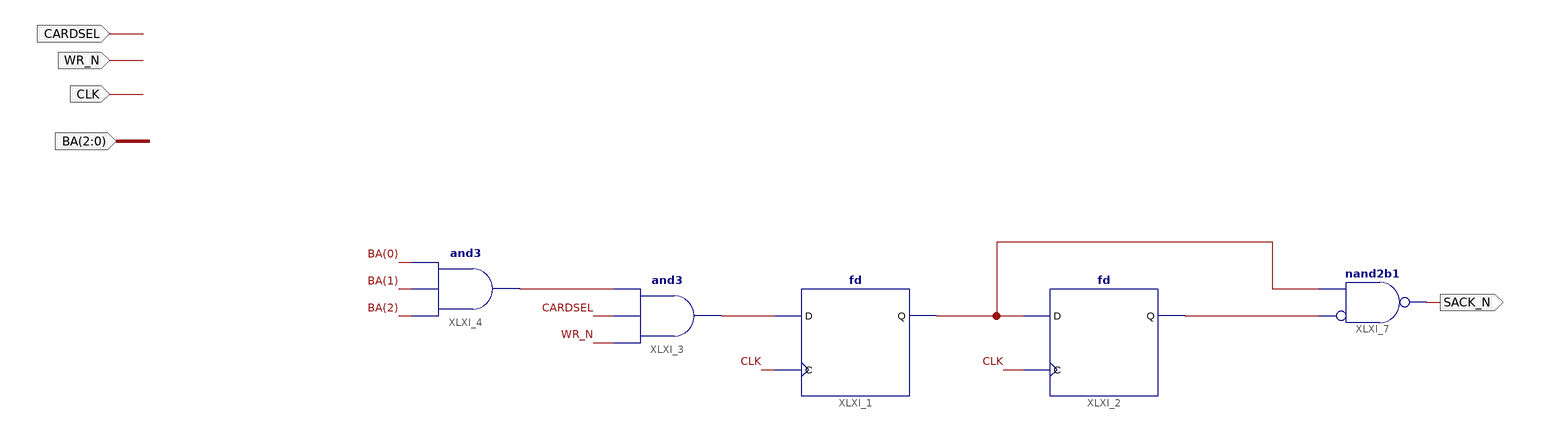
[diagram p0: schematic sheet 1]
// Xilinx ISE schematic Control.sch (spartan6) as structural Verilog: 5 symbols, 5 ports
module Control (
  input  CARDSEL,
  input  WR_N,
  input  CLK,
  input  [2:0] BA,
  output SACK_N
);

  wire XLXN_1, XLXN_2, XLXN_11, XLXN_15;

  fd XLXI_1 (.C(CLK), .D(XLXN_1), .Q(XLXN_2));
  fd XLXI_2 (.C(CLK), .D(XLXN_2), .Q(XLXN_15));
  and XLXI_3 (XLXN_1, WR_N, CARDSEL, XLXN_11);
  and XLXI_4 (XLXN_11, BA[2], BA[1], BA[0]);
  nand XLXI_7 (SACK_N, ~XLXN_15, XLXN_2);  // nand2b1
endmodule
